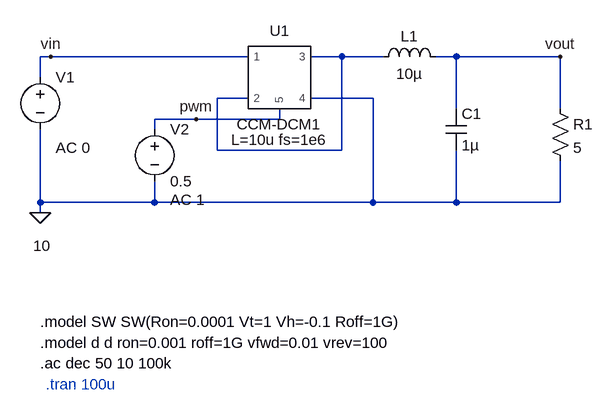
[diagram p0: schematic avg-ac.asc]
avg-ac.asc, the LTspice schematic file:
Version 4
SHEET 1 1492 680
WIRE -128 112 -144 112
WIRE 176 112 -128 112
WIRE 320 112 272 112
WIRE 384 112 320 112
WIRE 496 112 464 112
WIRE 656 112 496 112
WIRE -144 144 -144 112
WIRE 176 176 128 176
WIRE 368 176 272 176
WIRE 496 192 496 112
WIRE 656 192 656 112
WIRE 96 208 32 208
WIRE 224 208 224 192
WIRE 224 208 96 208
WIRE 32 224 32 208
WIRE 128 256 128 176
WIRE 320 256 320 112
WIRE 320 256 128 256
WIRE -144 336 -144 224
WIRE 32 336 32 304
WIRE 32 336 -144 336
WIRE 368 336 368 176
WIRE 368 336 32 336
WIRE 496 336 496 256
WIRE 496 336 368 336
WIRE 656 336 656 272
WIRE 656 336 496 336
WIRE -144 352 -144 336
FLAG -144 352 0
FLAG 656 112 vout
FLAG -128 112 vin
FLAG 96 208 pwm
SYMBOL voltage -144 128 R0
WINDOW 123 24 124 Left 2
WINDOW 39 0 0 Left 0
WINDOW 3 -11 275 Left 2
SYMATTR Value2 AC 0
SYMATTR Value 10
SYMATTR InstName V1
SYMBOL ind 368 128 R270
WINDOW 0 32 56 VTop 2
WINDOW 3 5 56 VBottom 2
SYMATTR InstName L1
SYMATTR Value 10µ
SYMBOL cap 480 192 R0
SYMATTR InstName C1
SYMATTR Value 1µ
SYMBOL res 640 176 R0
SYMATTR InstName R1
SYMATTR Value 5
SYMBOL AutoGenerated\\CCM-DCM1 224 144 R0
SYMATTR InstName U1
SYMBOL voltage 32 208 R0
WINDOW 123 24 124 Left 2
WINDOW 39 0 0 Left 0
SYMATTR Value2 AC 1
SYMATTR InstName V2
SYMATTR Value 0.5
TEXT -144 520 Left 2 !.model SW SW(Ron=0.0001 Vt=1 Vh=-0.1 Roff=1G)
TEXT -144 552 Left 2 !.model d d ron=0.001 roff=1G vfwd=0.01 vrev=100
TEXT -144 584 Left 2 !.ac dec 50 10 100k
TEXT -136 616 Left 2 ;.tran 100u

The netlist it stands for:
* avg-ac.asc
V1 vin 0 10 AC 0
L1 N001 vout 10µ
C1 vout 0 1µ
R1 vout 0 5
XU1 vin N001 N001 0 pwm CCM-DCM1 L=10u fs=1e6  ; pins 1 2 3 4 5
V2 pwm 0 0.5 AC 1
.model SW SW(Ron=0.0001 Vt=1 Vh=-0.1 Roff=1G)
.model d d ron=0.001 roff=1G vfwd=0.01 vrev=100
.ac dec 50 10 100k
* .tran 100u
.lib CCM-DCM1.mod
.backanno
.end